# EAGLE design project arm stm32f103 (EAGLE 7.1.0)
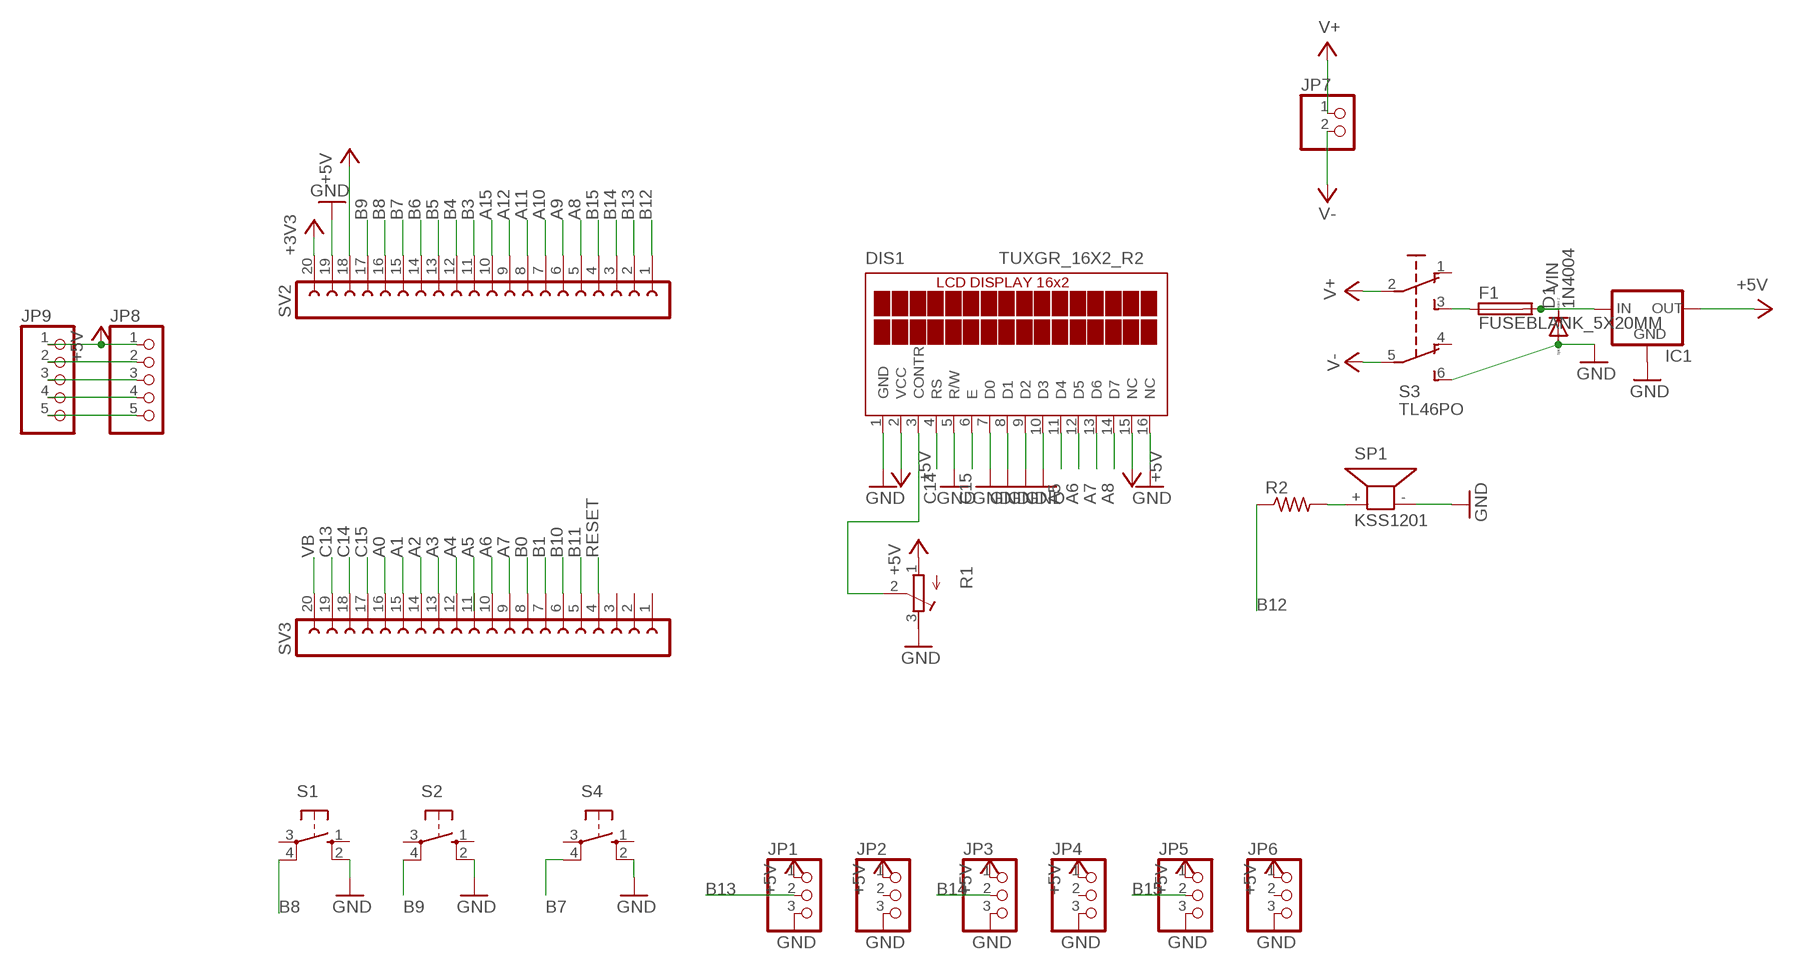
[diagram p0: schematic, sheet 1]

## Parts
D1  1N4004  [DO41-10]
DIS1  TUXGR_16X2_R2  [TUXGR_16X2_R2]
F1  FUSEBLANK_5X20MM  [FUSE_HOLDER_5X20MM]
IC1  78XXL  [78XXL]
JP1  PINHD-1X3  [1X03]
JP2  PINHD-1X3  [1X03]
JP3  PINHD-1X3  [1X03]
JP4  PINHD-1X3  [1X03]
JP5  PINHD-1X3  [1X03]
JP6  PINHD-1X3  [1X03]
JP7  PINHD-1X2  [1X02]
JP8  PINHD-1X5/90  [1X05/90]
JP9  PINHD-1X5/90  [1X05/90]
R1  R-TRIMM3339P  [RTRIM3339P]
R2  R-US_0204/7  [0204/7]
S1  10-XX  [B3F-10XX]
S2  10-XX  [B3F-10XX]
S3  TL46PO  [TL4XPO]
S4  10-XX  [B3F-10XX]
SP1  KSS1201  [KSS1201]
SV2  FE20-1  [FE20]
SV3  FE20-1  [FE20]

## Nets
+3V3: SV2.20
+5V: DIS1.2(VCC) DIS1.15(NC) IC1.OUT JP1.1 JP2.1 JP3.1 JP4.1 JP5.1 JP6.1 JP8.1 JP9.1 R1.1(E) SV2.18
A0: SV3.16
A1: SV3.15
A2: SV3.14
A3: SV3.13
A4: SV3.12
A5: DIS1.11(D4)
A6: DIS1.12(D5) SV3.10
A7: DIS1.13(D6) SV3.9
A8: DIS1.14(D7) SV2.5
A9: SV2.6
A10: SV2.7
A11: SV2.8
A12: SV2.9
A15: SV2.10
B0: SV3.8
B1: SV3.7
B3: SV2.11
B4: SV2.12
B5: SV2.13
B6: SV2.14
B7: S4.4(P1) SV2.15
B8: S1.4(P1) SV2.16
B9: S2.4(P1) SV2.17
B10: SV3.6
B11: SV3.5
B12: R2.1 SV2.1
B13: JP1.2 SV2.2
B14: JP3.2 SV2.3
B15: JP5.2 SV2.4
C13: SV3.19
C14: DIS1.4(RS) SV3.18
C15: DIS1.6(E) SV3.17
GND: D1.A DIS1.1(GND) DIS1.5(R/W) DIS1.7(D0) DIS1.8(D1) DIS1.9(D2) DIS1.10(D3) DIS1.16(NC) IC1.GND JP1.3 JP2.3 JP3.3 JP4.3 JP5.3 JP6.3 R1.3(A) S1.2(S1) S2.2(S1) S3.6(S1) S4.2(S1) SP1.- SV2.19
N$1: R2.2 SP1.+
N$2: F1.1 S3.3(S)
N$3: DIS1.3(CONTR) R1.2(S)
N$9: JP8.2 JP9.2
N$10: JP8.3 JP9.3
N$11: JP8.4 JP9.4
N$12: JP8.5 JP9.5
RESET: SV3.4
V+: JP7.1 S3.2(P)
V-: JP7.2 S3.5(P1)
VB: SV3.20
VIN: D1.C F1.2 IC1.IN
Unconnected: JP2.2 JP4.2 JP6.2 S1.1(S) S1.3(P) S2.1(S) S2.3(P) S3.1(O) S3.4(O1) S4.1(S) S4.3(P) SV3.1 SV3.2 SV3.3 SV3.11

## Library data of the parts
D1 = diode:1N4004: DIODE general purpose rectifier, 1 A
DIS1 = display-lcd:TUXGR_16X2_R2: Tuxgraphics LCD display 16x2 characters reflective, without background light Source: tuxgr_12x2_r2.pdf; OC_FARNELL: unknown; OC_NEWARK: unknown
F1 = fuse:FUSE: Fuse; OC_FARNELL: unknown; OC_NEWARK: unknown
IC1 = v-reg:78XXL: VOLTAGE REGULATOR
JP1-JP6 = pinhead:PINHD-1X3: PIN HEADER
JP7 = pinhead:PINHD-1X2: PIN HEADER
JP8 JP9 = pinhead:PINHD-1X5: PIN HEADER
R1 = resistor:R-TRIMM: Trimm resistor
R2 = rcl:R-US_: RESISTOR, American symbol
S1 S2 S4 = switch-omron:10-XX: OMRON SWITCH; MPN: B3F-1000; OC_FARNELL: 176432; OC_NEWARK: 36M3542
S3 = switch:TL46PO: TINY SWITCH ON - ON Source: http://www2.produktinfo.conrad.com/datenblaetter/700000-724999/705152-da-01-de-Subminiaturschalter_TL_36YO.pdf
SP1 = buzzer:KSS1201: SPEAKER Source: Schukat; OC_FARNELL: unknown; OC_NEWARK: unknown
SV2 SV3 = con-lsta:FE20-1: FEMALE HEADER; OC_FARNELL: unknown; OC_NEWARK: unknown

## Board
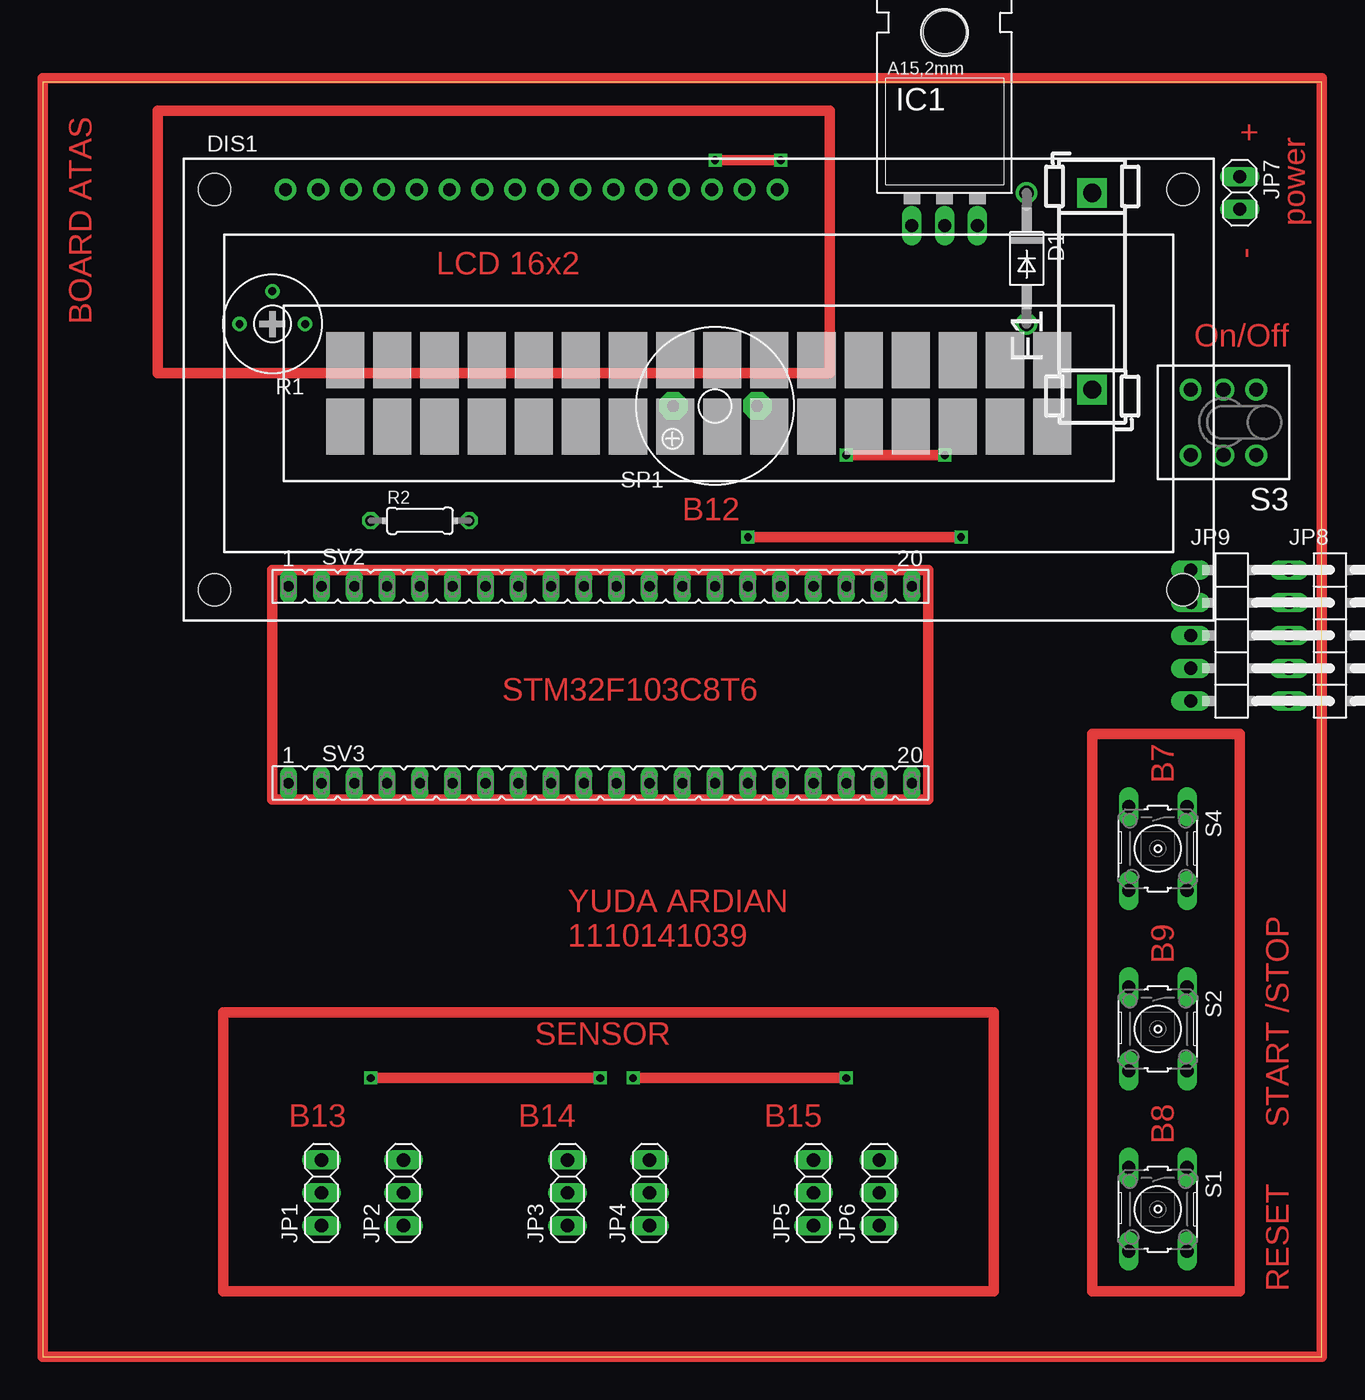
[diagram p1: board, top side]
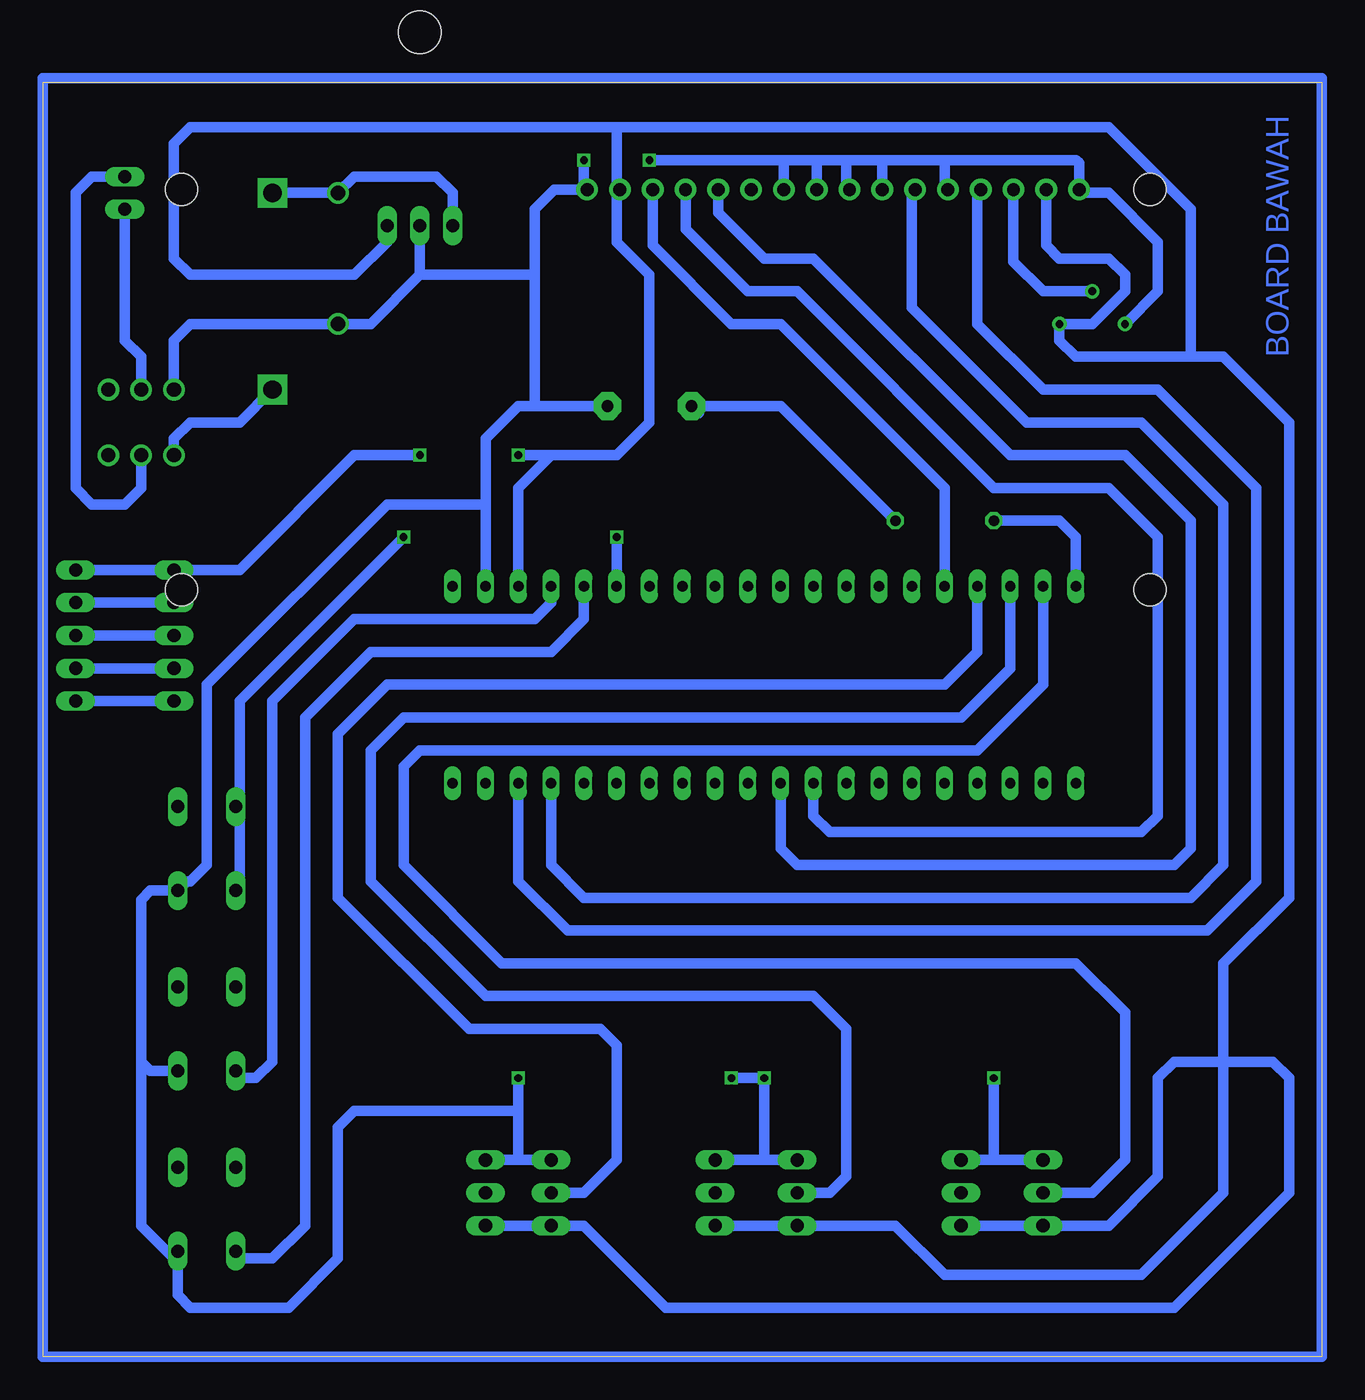
[diagram p2: board, bottom side, seen from below]

Size 99.04 x 98.73 mm. Coordinates in mm from the lower left corner, seen from the top.
Outline: 0,0 99.04,0 99.04,98.73 0,98.73 0,0
Copper layers (1*16): Top 0.035mm / dielectric 1.5mm / Bottom 0.035mm
Design rules "default": minimum track width 10mil, minimum drill 24mil, track to track 8mil, track to pad 8mil, pad to pad 8mil, via to via 8mil, smd to smd 8mil, copper to edge 40mil, drill to drill 8mil, minimum pad ring 10mil, minimum via ring 8mil, stop-mask expansion 4mil, vias tented up to drill 0mil, thermal gap 10mil

### Footprints (pad centres in the part's own frame; a part is rotated, then mirrored left to right if it is on the bottom)
DO41-10 = drill 1.118: A 5.08,0; C -5.08,0
TUXGR_16X2_R2 = drill 1 pad 1.676: 1 -32,15.5; 2 -29.46,15.5; 3 -26.92,15.5; 4 -24.38,15.5; 5 -21.84,15.5; 6 -19.3,15.5; 7 -16.76,15.5; 8 -14.22,15.5; 9 -11.68,15.5; 10 -9.14,15.5; 11 -6.6,15.5; 12 -4.06,15.5; 13 -1.52,15.5; 14 1.02,15.5; 15 3.56,15.5; 16 6.1,15.5 | hole 2.5: -37.5,-15.5; 37.5,-15.5; -37.5,15.5; 37.5,15.5
FUSE_HOLDER_5X20MM = drill 1.422 pad 2.286 square: 1 0,0; 2 15.24,0
78XXL = drill 1.016 long: GND 0,-3.81; IN -2.54,-3.81; OUT 2.54,-3.81 | hole 3.302: 0,11.176
1X03 = drill 1.016 long: 1 -2.54,0; 2 0,0; 3 2.54,0
1X02 = drill 1.016 long: 1 -1.27,0; 2 1.27,0
1X05/90 = drill 1.016 long: 1 -5.08,-3.81; 2 -2.54,-3.81; 3 0,-3.81; 4 2.54,-3.81; 5 5.08,-3.81
RTRIM3339P = drill 0.61: 1 -2.54,0; 2 0,-2.54; 3 2.54,0
0204/7 = drill 0.813 octagon: 1 -3.81,0; 2 3.81,0
B3F-10XX = drill 1.016 long: 1 -3.251,2.261; 2 3.251,2.261; 3 -3.251,-2.261; 4 3.251,-2.261
TL4XPO = drill 1.1 pad 1.676: 1 -2.54,2.54; 2 0,2.54; 3 2.54,2.54; 4 -2.54,-2.54; 5 0,-2.54; 6 2.54,-2.54
KSS1201 = drill 0.914 pad 2.159 octagon: + 3.251,0; - -3.251,0
FE20 = drill 0.813 long: 1 -24.13,0; 2 -21.59,0; 3 -19.05,0; 4 -16.51,0; 5 -13.97,0; 6 -11.43,0; 7 -8.89,0; 8 -6.35,0; 9 -3.81,0; 10 -1.27,0; 11 1.27,0; 12 3.81,0; 13 6.35,0; 14 8.89,0; 15 11.43,0; 16 13.97,0; 17 16.51,0; 18 19.05,0; 19 21.59,0; 20 24.13,0

### Placement (x,y rotation side)
D1  76.2,85.09 270 top
DIS1  50.8,74.93 0 top
F1  81.28,74.93 90 top
IC1  69.85,91.44 0 top
JP1  21.59,12.7 90 top
JP2  27.94,12.7 90 top
JP3  40.64,12.7 90 top
JP4  46.99,12.7 90 top
JP5  59.69,12.7 90 top
JP6  64.77,12.7 90 top
JP7  92.71,90.17 270 top
JP8  100.33,55.88 270 top
JP9  92.71,55.88 270 top
R1  17.78,80.01 180 top
R2  29.21,64.77 0 top
S1  86.36,11.43 270 top
S2  86.36,25.4 270 top
S3  91.44,72.39 180 top
S4  86.36,39.37 270 top
SP1  52.07,73.66 180 top
SV2  43.18,59.69 0 top
SV3  43.18,44.45 0 top

### Tracks (layer width: path | path; a pad name or v marks a point on that pad's centre or on a via)
+5V  (via drill 0.6)
  Top 0.813: v69.85,69.85 v62.23,69.85
  Bottom 0.813: IC1.OUT 72.39,86.36 74.93,83.82 87.63,83.82 88.9,85.09 88.9,93.98 87.63,95.25 54.61,95.25 | 54.61,95.25 54.61,90.68 DIS1.15 54.61,90.18 54.61,86.36 52.07,83.82 52.07,72.39 54.61,69.85 59.69,69.85 | 54.61,95.25 16.51,95.25 10.16,88.9 10.16,77.47 | DIS1.2 21.34,86.11 20.32,85.09 16.51,85.09 15.24,83.82 15.24,82.55 17.78,80.01 R1.1 20.32,78.74 19.05,77.47 10.16,77.47 | SV2.18 62.23,67.31 59.69,69.85 | JP4.1 JP3.1 33.02,10.16 29.21,6.35 13.97,6.35 7.62,12.7 7.62,22.86 | JP6.1 JP5.1 57.15,10.16 50.8,3.81 11.43,3.81 2.54,12.7 2.54,21.59 3.81,22.86 7.62,22.86 | JP2.1 JP1.1 16.51,10.16 12.7,13.97 12.7,21.59 11.43,22.86 7.62,22.86 | 10.16,77.47 7.62,77.47 2.54,72.39 2.54,35.56 7.62,30.48 7.62,22.86 | JP8.1 JP9.1 83.82,60.96 74.93,69.85 v69.85,69.85 | v62.23,69.85 59.69,69.85
A6
  Bottom 0.813: DIS1.12 46.74,88.65 43.18,85.09 39.37,85.09 24.13,69.85 15.24,69.85 10.16,64.77 10.16,39.37 11.43,38.1 40.64,38.1 41.91,39.37 SV3.10
A7
  Bottom 0.813: DIS1.13 49.28,87.38 44.45,82.55 40.64,82.55 25.4,67.31 16.51,67.31 12.7,63.5 12.7,41.91 13.97,40.64 38.1,40.64 39.37,41.91 SV3.9
A8
  Bottom 0.813: DIS1.14 51.82,86.11 45.72,80.01 41.91,80.01 29.21,67.31 SV2.5
B7  (via drill 0.6)
  Top 0.813: v71.12,63.5 v54.61,63.5
  Bottom 0.813: v54.61,63.5 SV2.15 | v71.12,63.5 83.82,50.8 83.82,36.4 S4.4
B8
  Bottom 0.813: S1.4 83.54,7.62 81.28,7.62 78.74,10.16 78.74,49.53 73.66,54.61 59.69,54.61 57.15,57.15 SV2.16
B9
  Bottom 0.813: SV2.17 59.69,58.42 60.96,57.15 74.93,57.15 81.28,50.8 81.28,22.86 82.55,21.59 83.54,21.59 S2.4
B12
  Bottom 0.813: R2.1 20.32,64.77 19.05,63.5 SV2.1
B13
  Bottom 0.813: JP1.2 17.78,12.7 15.24,15.24 15.24,26.67 19.05,30.48 63.5,30.48 71.12,38.1 71.12,45.72 69.85,46.99 26.67,46.99 21.59,52.07 SV2.2
B14
  Bottom 0.813: SV2.3 24.13,53.34 27.94,49.53 71.12,49.53 73.66,46.99 73.66,36.83 64.77,27.94 39.37,27.94 36.83,25.4 36.83,13.97 38.1,12.7 JP3.2
B15
  Bottom 0.813: JP5.2 57.15,12.7 54.61,15.24 54.61,24.13 55.88,25.4 66.04,25.4 76.2,35.56 76.2,48.26 72.39,52.07 29.21,52.07 26.67,54.61 SV2.4
C14
  Bottom 0.813: SV3.18 62.23,36.83 58.42,33.02 8.89,33.02 5.08,36.83 5.08,67.31 12.7,74.93 21.59,74.93 26.67,80.01 26.67,90.17 DIS1.4
C15
  Bottom 0.813: SV3.17 59.69,38.1 57.15,35.56 10.16,35.56 7.62,38.1 7.62,66.04 13.97,72.39 22.86,72.39 31.75,81.28 31.75,90.18 DIS1.6
GND  (via drill 0.6)
  Top 0.813: v52.07,92.71 v57.15,92.71 | v25.4,21.59 v43.18,21.59 | v45.72,21.59 v62.23,21.59
  Bottom 0.813: S3.6 88.9,78.74 87.63,80.01 D1.A 73.66,80.01 69.85,83.82 | 69.85,83.82 IC1.GND | DIS1.1 18.8,92.46 19.05,92.71 29.21,92.71 | 29.21,92.71 29.21,90.68 DIS1.5 | 34.29,92.71 29.21,92.71 | DIS1.7 34.04,92.46 34.29,92.71 | 34.29,92.71 36.83,92.71 | 36.83,92.71 36.83,90.68 DIS1.8 | DIS1.9 39.12,92.46 39.37,92.71 | 39.37,92.71 36.83,92.71 | DIS1.10 41.66,92.46 41.91,92.71 | 41.91,92.71 39.37,92.71 | 41.91,92.71 v52.07,92.71 | v57.15,92.71 57.15,90.68 DIS1.16 59.43,90.43 60.96,88.9 60.96,83.82 | 19.05,90.18 DIS1.1 | DIS1.1 18.54,90.17 16.51,90.17 12.7,86.36 12.7,82.55 R1.3 | SP1.- 60.96,73.66 | 60.96,73.66 62.23,73.66 64.77,71.12 64.77,66.04 | 64.77,66.04 SV2.19 | 69.85,83.82 60.96,83.82 | 60.96,83.82 60.96,73.66 | 62.23,15.24 JP6.3 | JP4.3 43.18,15.24 | 43.18,15.24 JP3.3 | JP1.3 25.4,15.24 | 25.4,15.24 JP2.3 | 91.44,22.86 91.44,10.16 88.9,7.62 88.9,7.9 S1.2 88.62,4.8 87.63,3.81 80.01,3.81 76.2,7.62 76.2,17.78 74.93,19.05 62.23,19.05 | S2.2 90.73,22.15 91.44,22.86 | 25.4,15.24 v25.4,21.59 | 43.18,15.24 v43.18,21.59 v45.72,21.59 | JP5.3 62.23,15.24 | 62.23,15.24 62.23,19.05 | 62.23,19.05 v62.23,21.59 | 64.77,66.04 72.39,66.04 86.36,52.07 86.36,38.1 87.63,36.83 87.91,36.83 S4.2 90.73,36.12 91.44,35.41 91.44,22.86
N$1
  Bottom 0.813: 48.26,73.1 SP1.+ 41.91,73.66 R2.2
N$2
  Bottom 0.813: S3.3 88.9,71.12 87.63,72.39 83.82,72.39 F1.1
N$3
  Bottom 0.813: DIS1.3 23.88,84.84 21.59,82.55 R1.2
N$4
  Bottom 0.813: 0,99.06 0,97.79 0,96.52 0,0 99.06,0 99.06,99.06 0,99.06
N$5
  Top 0.813: 0,99.06 0,0 99.06,0 99.06,99.06 0,99.06
N$6
  Top 0.813: 81.28,5.08 92.71,5.08 92.71,48.26 81.28,48.26 81.28,5.08
N$7
  Top 0.813: 13.97,26.67 13.97,5.08 73.66,5.08 73.66,26.67 13.97,26.67
N$8
  Top 0.813: 17.78,60.96 17.78,43.18 68.58,43.18 68.58,60.96 17.78,60.96
N$9
  Bottom 0.813: JP8.2 JP9.2
N$10
  Bottom 0.813: JP9.3 JP8.3
N$11
  Bottom 0.813: JP9.4 JP8.4
N$12
  Bottom 0.813: JP9.5 JP8.5
N$13
  Top 0.813: 8.89,95.25 8.89,76.2 60.96,76.2 60.96,96.52 8.89,96.52 8.89,95.25
V+
  Bottom 0.813: JP7.1 95.25,91.44 96.52,90.17 96.52,67.31 95.25,66.04 92.71,66.04 91.44,67.31 S3.2
V-
  Bottom 0.813: JP7.2 92.71,78.74 91.44,77.47 S3.5
VIN
  Bottom 0.813: F1.2 D1.C 74.93,91.44 68.58,91.44 67.31,90.17 IC1.IN

### Text on the board
Top: + | power | - | LCD 16x2 | BOARD ATAS | On/Off | B12 | STM32F103C8T6 | B7 | YUDA ARDIAN / 1110141039 | B9 | /STOP | SENSOR | B13 | B14 | B15 | START | B8 | RESET
Bottom: BOARD BAWAH